# Altium schematic sheet testboard_chip1_poling.SchDoc
size E
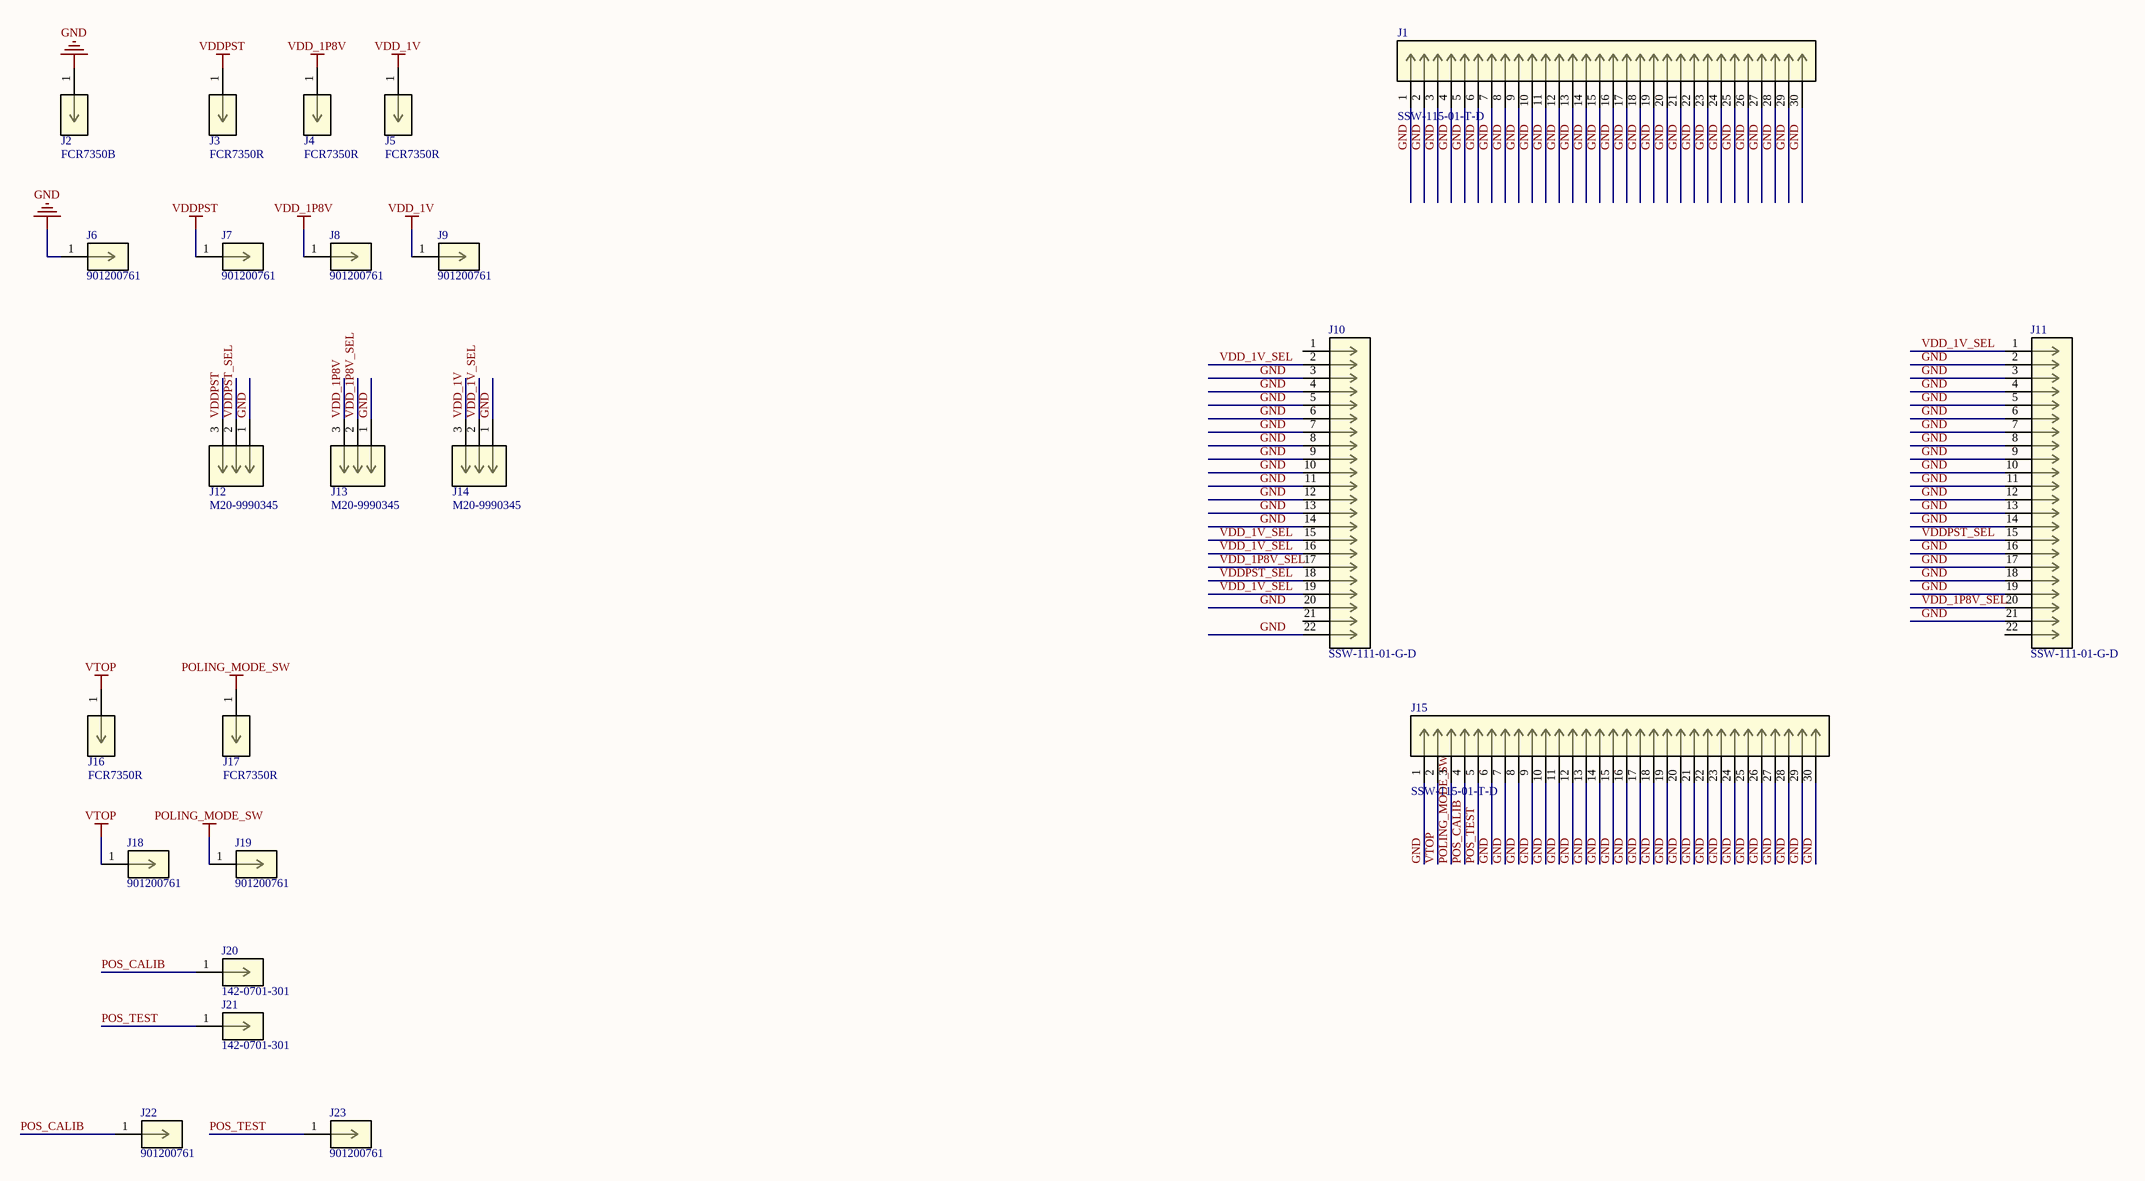
[diagram p0: testboard_chip1_poling.SchDoc]

## Parts
J1  SSW-115-01-T-D  [CON30_2X15_TU_SSQ]
J2  FCR7350B  [CONN1_FCR7350R_CLF]
J3  FCR7350R  [CONN1_FCR7350R_CLF]
J4  FCR7350R  [CONN1_FCR7350R_CLF]
J5  FCR7350R  [CONN1_FCR7350R_CLF]
J6  901200761  [CONN_90120-0761_MOL]
J7  901200761  [CONN_90120-0761_MOL]
J8  901200761  [CONN_90120-0761_MOL]
J9  901200761  [CONN_90120-0761_MOL]
J10  SSW-111-01-G-D  [CON23_2X11_TU_SSQ]
J11  SSW-111-01-G-D  [CON23_2X11_TU_SSQ]
J12  M20-9990345  [CONN_M20-99903XX_HRW]
J13  M20-9990345  [CONN_M20-99903XX_HRW]
J14  M20-9990345  [CONN_M20-99903XX_HRW]
J15  SSW-115-01-T-D  [CON30_2X15_TU_SSQ]
J16  FCR7350R  [CONN1_FCR7350R_CLF]
J17  FCR7350R  [CONN1_FCR7350R_CLF]
J18  901200761  [CONN_90120-0761_MOL]
J19  901200761  [CONN_90120-0761_MOL]
J20  142-0701-301  [CONN_142-0701-301_CIN]
J21  142-0701-301  [CONN_142-0701-301_CIN]
J22  901200761  [CONN_90120-0761_MOL]
J23  901200761  [CONN_90120-0761_MOL]

## Nets
GND: J1.1 J1.2 J1.3 J1.4 J1.5 J1.6 J1.7 J1.8 J1.9 J1.10 J1.11 J1.12 J1.13 J1.14 J1.15 J1.16 J1.17 J1.18 J1.19 J1.20 J1.21 J1.22 J1.23 J1.24 J1.25 J1.26 J1.27 J1.28 J1.29 J1.30 J2.1 J6.1 J10.3 J10.4 J10.5 J10.6 J10.7 J10.8 J10.9 J10.10 J10.11 J10.12 J10.13 J10.14 J10.20 J10.22 J11.2 J11.3 J11.4 J11.5 J11.6 J11.7 J11.8 J11.9 J11.10 J11.11 J11.12 J11.13 J11.14 J11.16 J11.17 J11.18 J11.19 J11.21 J12.1 J13.1 J14.1 J15.1 J15.6 J15.7 J15.8 J15.9 J15.10 J15.11 J15.12 J15.13 J15.14 J15.15 J15.16 J15.17 J15.18 J15.19 J15.20 J15.21 J15.22 J15.23 J15.24 J15.25 J15.26 J15.27 J15.28 J15.29 J15.30
POLING_MODE_SW: J15.3 J17.1 J19.1
VDD_1P8V: J4.1 J8.1 J13.3
VDD_1V: J5.1 J9.1 J14.3
VDDPST: J3.1 J7.1 J12.3
VTOP: J15.2 J16.1 J18.1
POS_CALIB: J15.4 J20.1 J22.1
POS_TEST: J15.5 J21.1 J23.1
VDD_1P8V_SEL: J10.17 J11.20 J13.2
VDD_1V_SEL: J10.2 J10.15 J10.16 J10.19 J11.1 J14.2
VDDPST_SEL: J10.18 J11.15 J12.2

Not connected (* = marked no-connect by the designer): J10 1 21; J11 22

## Library data of the parts
J1 J15 = SSW-115-01-T-D: No Description Available; Mfr_Name: Samtec Inc; Copyright: Copyright (C) 2022 Ultra Librarian. All rights reserved.; Manufacturer_Part_Number: SSW-115-01-T-D; RefDes: RefDes; Type: DEV
J2-J5 J16 J17 = FCR7350R: No Description Available; Mfr_Name: Cliff; Copyright: Copyright (C) 2022 Ultra Librarian. All rights reserved.; Manufacturer_Part_Number: FCR7350R; RefDes: RefDes; Type: DEV
J6-J9 J18 J19 J22 J23 = 901200761: No Description Available; Mfr_Name: Molex Connector Corporation; Copyright: Copyright (C) 2022 Ultra Librarian. All rights reserved.; Manufacturer_Part_Number: 901200761; RefDes: RefDes; Type: DEV
J10 J11 = SSW-111-01-G-D: No Description Available; Mfr_Name: Samtec Inc; Copyright: Copyright (C) 2022 Ultra Librarian. All rights reserved.; Manufacturer_Part_Number: SSW-111-01-G-D; RefDes: RefDes; Type: DEV
J12-J14 = M20-9990345: No Description Available; Mfr_Name: Harwin; Copyright: Copyright (C) 2022 Ultra Librarian. All rights reserved.; Manufacturer_Part_Number: M20-9990345; RefDes: RefDes; Type: DEV
J20 J21 = 142-0701-301: No Description Available; Mfr_Name: Cinch Connectivity Solutions; Copyright: Copyright (C) 2022 Ultra Librarian. All rights reserved.; Manufacturer_Part_Number: 142-0701-301; RefDes: RefDes; Type: DEV